# Altium project GP1287AI_VFD_BOARD.PrjPcb
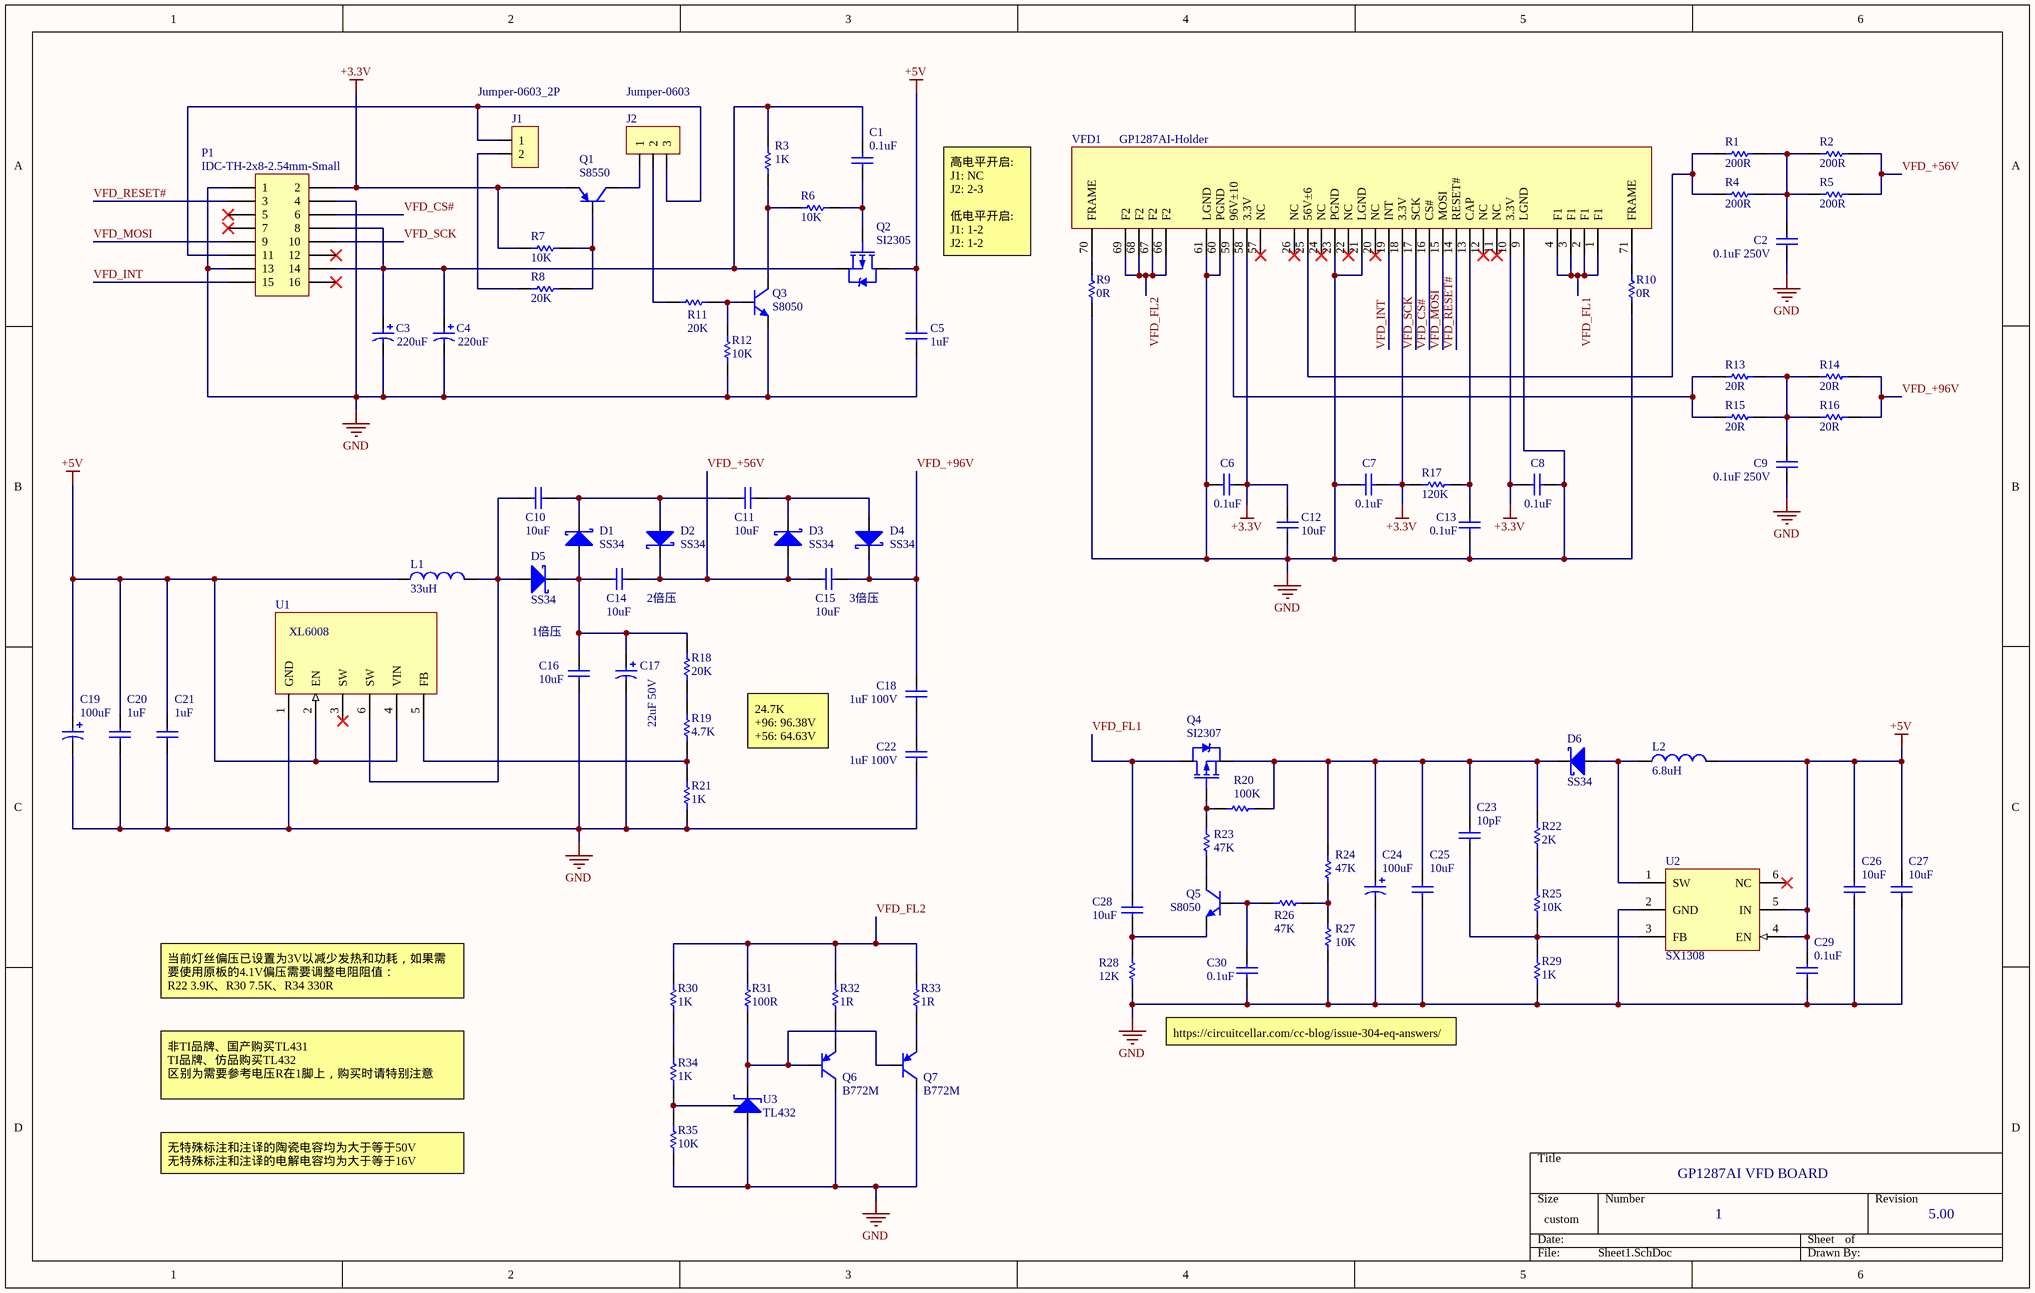
[diagram p0: Sheet1.SchDoc]
PCBName: GP1287AI VFD BOARD; Revision: 5.00
1 sheet, 87 parts. Net scope: global (net labels, ports and power ports of the same name join across sheets).
Board file: PCB1.PcbDoc

## Sheet Sheet1.SchDoc
size 381 x 241 mm; SheetNumber: 1; SheetTotal: 1

### Parts
C1  0.1uF  [0603-CAP]
C2  0.1uF 250V  [1206-CAP]
C3  220uF  [6.3*7.7-SMD-CAP]
C4  220uF  [6.3*7.7-SMD-CAP]
C5  1uF  [1206-CAP]
C6  0.1uF  [0603-CAP]
C7  0.1uF  [0603-CAP]
C8  0.1uF  [0603-CAP]
C9  0.1uF 250V  [1206-CAP]
C10  10uF  [1206-CAP]
C11  10uF  [1206-CAP]
C12  10uF  [1206-CAP]
C13  0.1uF  [0603-CAP]
C14  10uF  [1206-CAP]
C15  10uF  [1206-CAP]
C16  10uF  [1206-CAP]
C17  22uF 50V  [6.3*5.4-SMD-CAP]
C18  1uF 100V  [1206-CAP]
C19  100uF  [6.3*5.4-SMD-CAP]
C20  1uF  [0603-CAP]
C21  1uF  [0603-CAP]
C22  1uF 100V  [1206-CAP]
C23  10pF  [0603-CAP]
C24  100uF  [6.3*5.4-SMD-CAP]
C25  10uF  [1206-CAP]
C26  10uF  [1206-CAP]
C27  10uF  [1206-CAP]
C28  10uF  [1206-CAP]
C29  0.1uF  [0603-CAP]
C30  0.1uF  [0603-CAP]
D1  SS34  [DO-214AC-DIODE-SC_M]
D2  SS34  [DO-214AC-DIODE-SC_M]
D3  SS34  [DO-214AC-DIODE-SC_M]
D4  SS34  [DO-214AC-DIODE-SC_M]
D5  SS34  [DO-214AC-DIODE-SC_M]
D6  SS34  [DO-214AC-DIODE-SC_M]
J1  Jumper-0603_2P  [0603-JUMPER_2P]
J2  Jumper-0603  [0603-JUMPER]
L1  33uH  [SMD0650_M]
L2  6.8uH  [SMD0650_M]
P1  IDC-TH-2x8-2.54mm-Small  [IDC_TH_L_SMALL_16P]
Q1  S8550  [SOT-23-3_M]
Q2  SI2305  [SOT-23-3_M]
Q3  S8050  [SOT-23-3_M]
Q4  SI2307  [SOT-23-3_M]
Q5  S8050  [SOT-23-3_M]
Q6  B772M  [TO252-2L_M]
Q7  B772M  [TO252-2L_M]
R1  200R  [1206-RES]
R2  200R  [1206-RES]
R3  1K  [0603-RES]
R4  200R  [1206-RES]
R5  200R  [1206-RES]
R6  10K  [0603-RES]
R7  10K  [0603-RES]
R8  20K  [0603-RES]
R9  0R  [0603-RES]
R10  0R  [0603-RES]
R11  20K  [0603-RES]
R12  10K  [0603-RES]
R13  20R  [1206-RES]
R14  20R  [1206-RES]
R15  20R  [1206-RES]
R16  20R  [1206-RES]
R17  120K  [0603-RES]
R18  20K  [0603-RES]
R19  4.7K  [0603-RES]
R20  100K  [0603-RES]
R21  1K  [0603-RES]
R22  2K  [0603-RES]
R23  47K  [0603-RES]
R24  47K  [0603-RES]
R25  10K  [0603-RES]
R26  47K  [0603-RES]
R27  10K  [0603-RES]
R28  12K  [0603-RES]
R29  1K  [0603-RES]
R30  1K  [0603-RES]
R31  100R  [0603-RES]
R32  1R  [1206-RES]
R33  1R  [1206-RES]
R34  1K  [0603-RES]
R35  10K  [0603-RES]
U1  XL6008  [TO252-5L_M]
U2  SX1308  [SOT-23-6_M]
U3  TL432  [SOT-23-3_M]
VFD1  GP1287AI-Holder  [GP1287AI-HOLDER]

### Nets
+3.3V: C6.2 C7.2 C8.1 C12.2 P1.2 Q1.2(E) R7.1 R17.1 VFD1.10(3.3V) VFD1.18(3.3V) VFD1.58(3.3V)
+5V: C5.2 C19.1 C20.2 C21.2 C26.2 C27.2 C29.2 L1.1 L2.2 Q2.3(D) U1.2(EN) U1.4(VIN) U2.4(EN) U2.5(IN)
GND: C2.1 C3.2 C4.2 C5.1 C6.1 C7.1 C8.2 C9.1 C12.1 C13.1 C16.1 C17.2 C19.2 C20.1 C21.1 C22.1 C24.2 C25.1 C26.1 C27.1 C29.1 C30.1 P1.1 P1.4 P1.13 Q3.2(E) Q6.2(C) Q7.2(C) R9.2 R10.2 R12.2 R21.2 R27.1 R28.1 R29.1 R35.1 U1.1(GND) U2.2(GND) U3.3(A) VFD1.9(LGND) VFD1.21(LGND) VFD1.23(PGND) VFD1.60(PGND) VFD1.61(LGND)
VFD_+56V: C14.2 C15.1 D2.1(K) D3.2(A) R2.1 R5.1
VFD_+96V: C15.2 C18.2 D4.1(K) R14.1 R16.1
VFD_CS#: P1.6 VFD1.16(CS#)
VFD_FL1: C28.2 Q4.3(D) VFD1.1(F1) VFD1.2(F1) VFD1.3(F1) VFD1.4(F1)
VFD_FL2: R30.2 R31.2 R32.2 R33.2 VFD1.66(F2) VFD1.67(F2) VFD1.68(F2) VFD1.69(F2)
VFD_INT: P1.15 VFD1.19(INT)
VFD_MOSI: P1.9 VFD1.15(MOSI)
VFD_RESET#: P1.3 VFD1.14(RESET#)
VFD_SCK: P1.10 VFD1.17(SCK)
NetC1_1: C1.1 Q2.1(G) R6.1
NetC1_2: C1.2 C3.1 C4.1 P1.8 P1.14 Q2.2(S) R3.2
NetC2_2: C2.2 R1.1 R2.2 R4.1 R5.2
NetC9_2: C9.2 R13.1 R14.2 R15.1 R16.2
NetC10_1: C10.1 D5.2(A) L1.2 U1.6(SW)
NetC10_2: C10.2 C11.1 D1.1(K) D2.2(A)
NetC11_2: C11.2 D3.1(K) D4.2(A)
NetC13_2: C13.2 R17.2 VFD1.13(CAP)
NetC14_1: C14.1 C16.2 C17.1 D1.2(A) D5.1(K) R18.1
NetC18_1: C18.1 C22.2
NetC23_1: C23.1 R25.1 R29.2 U2.3(FB)
NetC23_2: C23.2 C24.1 C25.2 D6.1(K) Q4.2(S) R20.2 R22.2 R24.2
NetC28_1: C28.1 Q5.2(E) R28.2
NetC30_2: C30.2 Q5.1(B) R26.1
NetD6_2: D6.2(A) L2.1 U2.1(SW)
NetJ1_1: J1.1 J2.3 P1.11
NetJ1_2: J1.2 R8.1
NetJ2_1: J2.1 Q1.3(C)
NetJ2_2: J2.2 R11.1
NetQ1_1: Q1.1(B) R7.2 R8.2
NetQ3_1: Q3.1(B) R11.2 R12.1
NetQ3_3: Q3.3(C) R3.1 R6.2
NetQ4_1: Q4.1(G) R20.1 R23.2
NetQ5_3: Q5.3(C) R23.1
NetQ6_1: Q6.1(B) Q7.1(B) R31.1 U3.2(K)
NetQ6_3: Q6.3(E) R32.1
NetQ7_3: Q7.3(E) R33.1
NetR1_2: R1.2 R4.2 VFD1.25(56V±6)
NetR9_1: R9.1 VFD1.70(FRAME)
NetR10_1: R10.1 VFD1.71(FRAME)
NetR13_2: R13.2 R15.2 VFD1.59(96V±10)
NetR18_2: R18.2 R19.1
NetR19_2: R19.2 R21.1 U1.5(FB)
NetR22_1: R22.1 R25.2
NetR24_1: R24.1 R26.2 R27.2
NetR30_1: R30.1 R34.2
NetR34_1: R34.1 R35.2 U3.1(R)

Not connected (* = marked no-connect by the designer): P1 5* 7* 12* 16*; U1 3(SW)*; U2 6(NC)*; VFD1 11(NC)* 12(NC)* 20(NC)* 22(NC)* 24(NC)* 26(NC)* 57(NC)*

### Notes on the sheet
- 高电平开启:
  J1: NC
  J2: 2-3
  低电平开启:
  J1: 1-2
  J2: 1-2
- 1倍压
- (near C14) 2倍压
- (near C15) 3倍压
- 24.7K
  +96: 96.38V
  +56: 64.63V
- 当前灯丝偏压已设置为3V以减少发热和功耗，如果需要使用原板的4.1V偏压需要调整电阻阻值：
  R22 3.9K、R30 7.5K、R34 330R
- https://circuitcellar.com/cc-blog/issue-304-eq-answers/
- 非TI品牌、国产购买TL431
  TI品牌、仿品购买TL432
  区别为需要参考电压R在1脚上，购买时请特别注意
- 无特殊标注和注译的陶瓷电容均为大于等于50V
  无特殊标注和注译的电解电容均为大于等于16V

### Library data of the parts
C1 C6-C8 C13 C20 C21 C23 C29 C30 = CAP-0603
C2 C5 C9-C12 C14-C16 C18 C22 C25-C28 = CAP-1206
C3 C4 = CAP-E-SMD-6.3*7.7
C17 C19 C24 = CAP-E-SMD-6.3*5.4
D1-D6 = Diode-Schottky-DO214AC
L1 L2 = Inductor-SMD0650
Q1 = PNP-SOT23-3
Q2 Q4 = PMOS-SOT23-3
Q3 Q5 = NPN-SOT23-3
Q6 Q7 = PNP-TO252-2L
R1 R2 R4 R5 R13-R16 R32 R33 = RES-1206
R3 R6-R12 R17-R31 R34 R35 = RES-0603
U1 = XL6008: 60V 3A  Buck-Boost Converter 400Khz (TO252-5L)
U2 = SX1308: 26V 2A Boost Converter 1.2MHz (SOT-23-6)
U3 = TL432-SOT23-3: Precision Programmable Reference
VFD1 = GP1287AI-Holder: 256*50 Graphic VFD